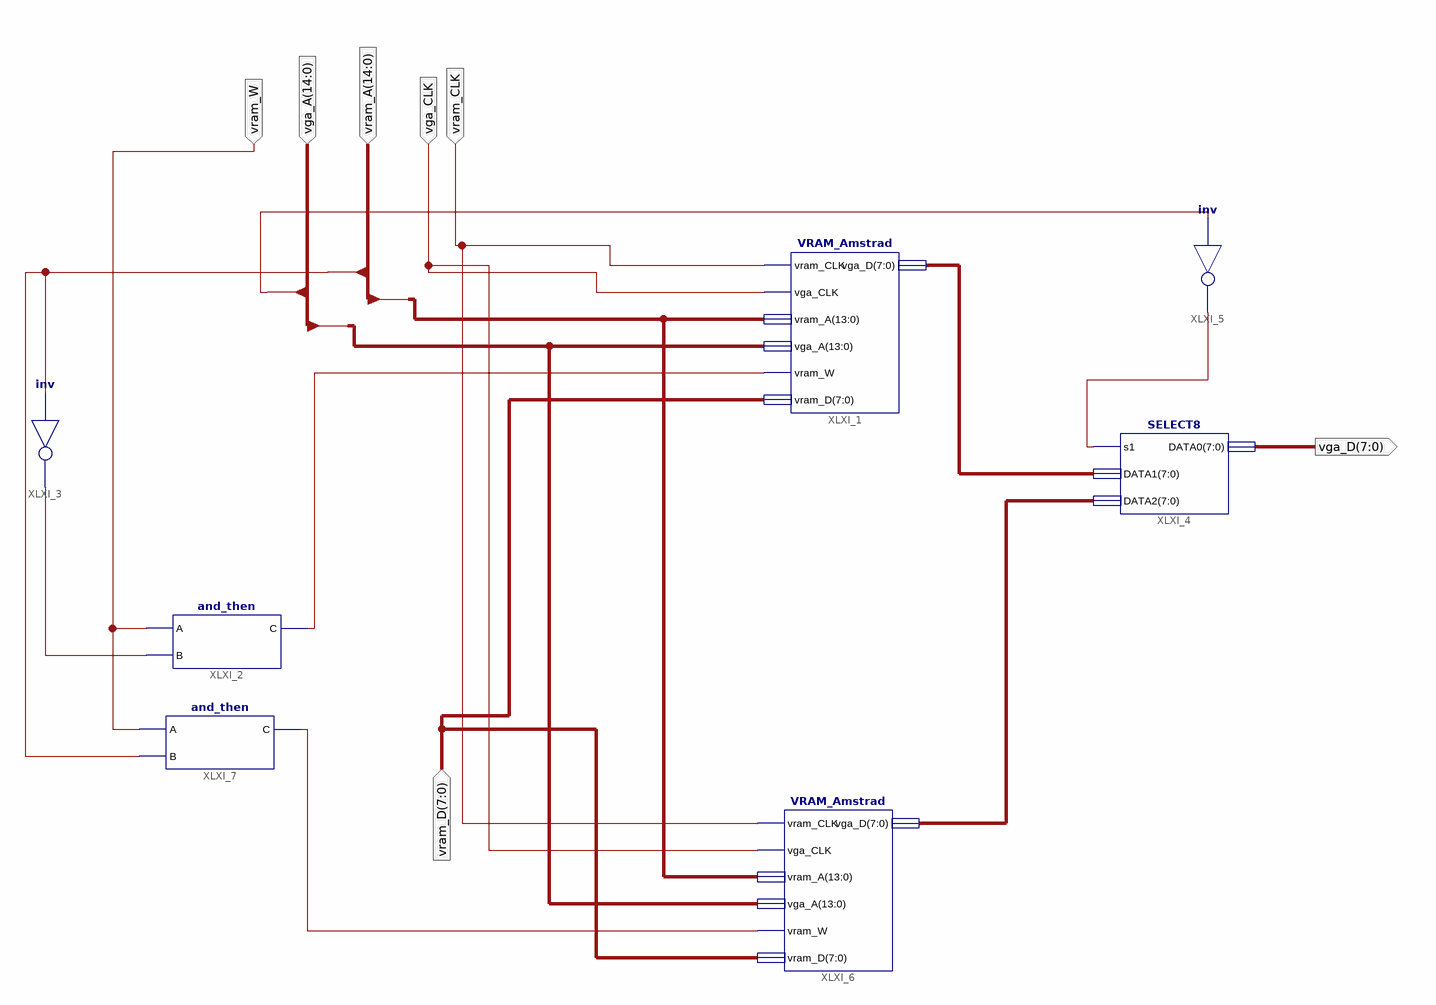
[diagram p0: schematic sheet 1]
// Xilinx ISE schematic VRAM32Ko_Amstrad.sch (spartan3e) as structural Verilog: 7 symbols, 7 ports
module VRAM32Ko_Amstrad (
  input  vram_CLK,
  input  vga_CLK,
  input  [14:0] vram_A,
  input  [14:0] vga_A,
  input  vram_W,
  input  [7:0] vram_D,
  output [7:0] vga_D
);

  wire XLXN_19, XLXN_21, XLXN_23, XLXN_31;
  wire [7:0] XLXN_40, XLXN_46;

  VRAM_Amstrad XLXI_1 (
    .vram_CLK(vram_CLK), .vga_CLK(vga_CLK), .vram_A(vram_A[13:0]), .vga_A(vga_A[13:0]), .vram_W(XLXN_19),
    .vram_D(vram_D), .vga_D(XLXN_40));
  and_then XLXI_2 (.A(vram_W), .B(XLXN_21), .C(XLXN_19));
  not XLXI_3 (XLXN_21, vram_A[14]);
  not XLXI_5 (XLXN_23, vga_A[14]);
  VRAM_Amstrad XLXI_6 (
    .vram_CLK(vram_CLK), .vga_CLK(vga_CLK), .vram_A(vram_A[13:0]), .vga_A(vga_A[13:0]), .vram_W(XLXN_31),
    .vram_D(vram_D), .vga_D(XLXN_46));
  and_then XLXI_7 (.A(vram_W), .B(vram_A[14]), .C(XLXN_31));
  SELECT8 XLXI_4 (.s1(XLXN_23), .DATA1(XLXN_40), .DATA2(XLXN_46), .DATA0(vga_D));
endmodule
